# EAGLE design electronics 2 2023 (EAGLE 9.6.2)

## Sheet 1 of 2
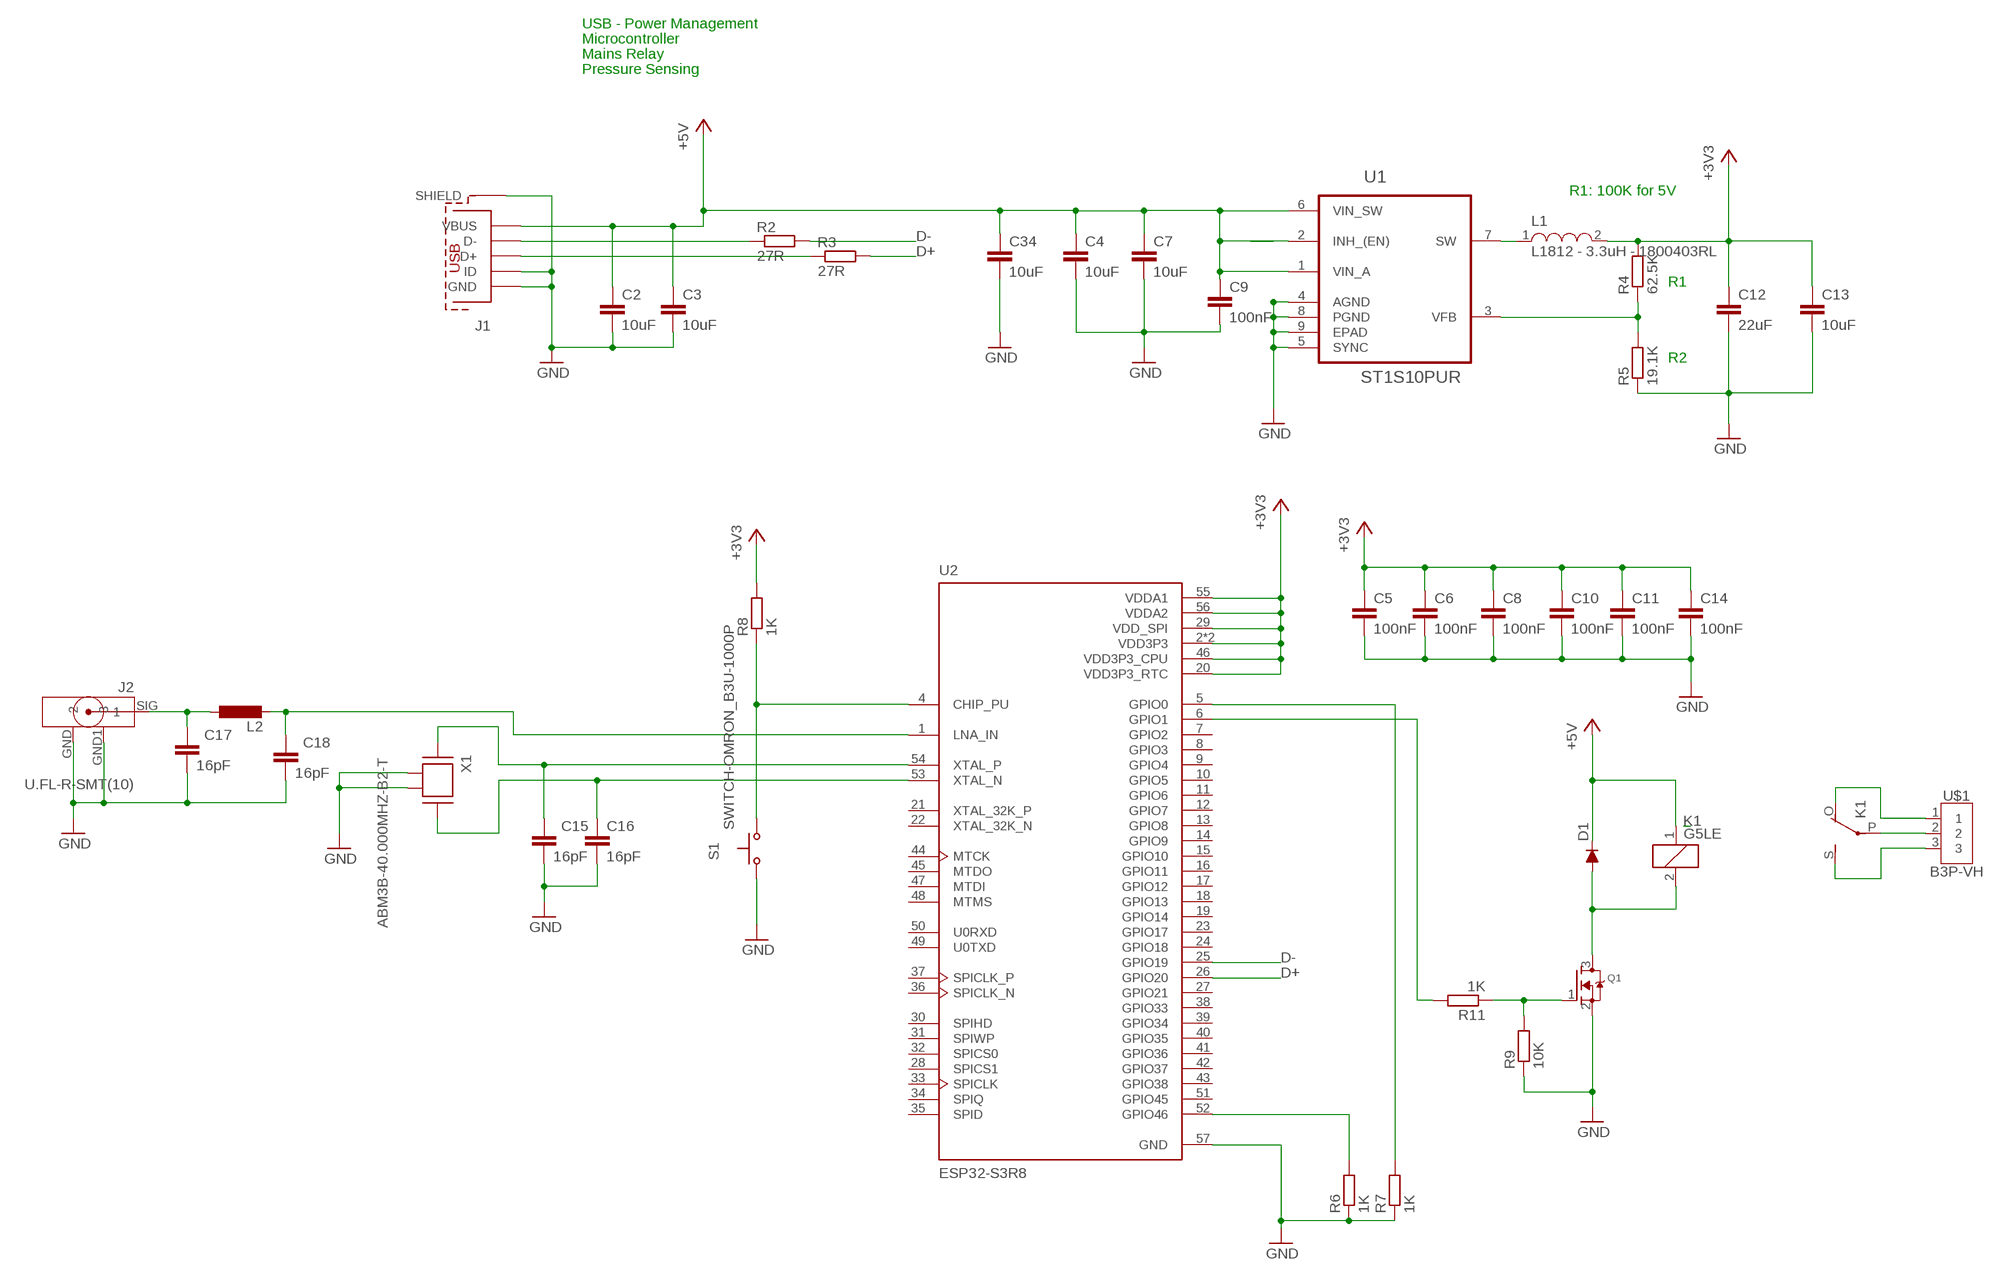
[diagram p0: schematic, sheet 1]

### Parts
C2  10uF  C-EUC0603  [C0603]
C3  10uF  C-EUC0603  [C0603]
C4  10uF  C-EUC0603  [C0603]
C5  100nF  C-EUC0402  [C0402]
C6  100nF  C-EUC0402  [C0402]
C7  10uF  C-EUC0603  [C0603]
C8  100nF  C-EUC0402  [C0402]
C9  100nF  C-EUC0402  [C0402]
C10  100nF  C-EUC0402  [C0402]
C11  100nF  C-EUC0402  [C0402]
C12  22uF  C-EUC0603  [C0603]
C13  10uF  C-EUC0603  [C0603]
C14  100nF  C-EUC0402  [C0402]
C15  16pF  C-EUC0402  [C0402]
C16  16pF  C-EUC0402  [C0402]
C17  16pF  C-EUC0402  [C0402]
C18  16pF  C-EUC0402  [C0402]
C34  10uF  C-EUC0603  [C0603]
D1  DIODE_DIODE-SOD123  [DIODE_SOD123]
J1  MICRO-USB-SOCKET  [629105136821]
J2  U.FL-R-SMT(10)  [U.FL-R-SMT(10)]
K1  G5LE  [G5LE]
L1  L1812 - 3.3uH - 1800403RL  INDUCTOR-L1812  [L1812]
L2  L-EUL2012C  [L2012C]
Q1  MOSFET-NREFLOW  [SOT23]
R2  27R  R-EU_R0402  [R0402]
R3  27R  R-EU_R0402  [R0402]
R4  62.5K  R-EU_R0402  [R0402]
R5  19.1K  R-EU_R0402  [R0402]
R6  1K  R-EU_R0402  [R0402]
R7  1K  R-EU_R0402  [R0402]
R8  1K  R-EU_R0402  [R0402]
R9  10K  R-EU_R0402  [R0402]
R11  1K  R-EU_R0402  [R0402]
S1  SWITCH-OMRON_B3U-1000P  [SWITCH-OMRON_B3U-1000P]
U1  ST1S10PUR  [DFN400X400X100-9N]
U2  ESP32-S3R8  [QFN40P700X700X90-57N]
U$1  B3P-VH  [B3P-VH_396_3N]
X1  ABM3B-40.000MHZ-B2-T  [ABM3B-40.000MHZ-B2-T]

### Nets
+3V3: C5.1 C6.1 C8.1 C10.1 C11.1 C12.1 C13.1 C14.1 L1.2 R4.2 R8.2 U2.2(VDD3P3) U2.3(VDD3P3) U2.20(VDD3P3_RTC) U2.29(VDD_SPI) U2.46(VDD3P3_CPU) U2.55(VDDA1) U2.56(VDDA2) ; also sheet 2
+5V: C2.1 C3.1 C4.1 C7.1 C9.1 C34.1 D1.C J1.1(VBUS) K1.1 U1.1(VIN_A) U1.2(INH_(EN)) U1.6(VIN_SW)
D+: R3.2 U2.26(GPIO20)
D-: R2.2 U2.25(GPIO19)
GND: C2.2 C3.2 C4.2 C5.2 C6.2 C7.2 C8.2 C9.2 C10.2 C11.2 C12.2 C13.2 C14.2 C15.2 C16.2 C17.2 C18.2 C34.2 J1.4(ID) J1.5(GND) J1.SHELL1(SHIELD) J1.SHELL2(SHIELD) J1.SHELL3(SHIELD) J1.SHELL(SHIELD) J2.GND J2.GND1 Q1.2(S) R5.1 R6.1 R7.1 R9.1 S1.1(P) U1.4(AGND) U1.5(SYNC) U1.8(PGND) U1.9(EPAD) U2.57(GND) X1.2 X1.4 ; also sheet 2
N$1: J1.2(D-) R2.1
N$2: J1.3(D+) R3.1
N$3: R4.1 R5.2 U1.3(VFB)
N$4: L1.1 U1.7(SW)
N$7: C15.1 U2.54(XTAL_P) X1.1
N$8: C16.1 U2.53(XTAL_N) X1.3
N$9: R6.2 U2.52(GPIO46)
N$10: R7.2 U2.5(GPIO0)
N$11: C18.1 L2.2 U2.1(LNA_IN)
N$12: C17.1 J2.SIG L2.1
N$13: R8.1 S1.2(S) U2.4(CHIP_PU)
N$14: D1.A K1.2 Q1.3(D)
N$16: K1.P(2:P) U$1.2
N$17: Q1.1(G) R9.2 R11.1
N$18: K1.O(2:O) U$1.1
N$19: R11.2 U2.6(GPIO1)
N$20: K1.S(2:S) U$1.3
Unconnected: U2.7(GPIO2) U2.8(GPIO3) U2.9(GPIO4) U2.10(GPIO5) U2.11(GPIO6) U2.12(GPIO7) U2.13(GPIO8) U2.14(GPIO9) U2.15(GPIO10) U2.16(GPIO11) U2.17(GPIO12) U2.18(GPIO13) U2.19(GPIO14) U2.21(XTAL_32K_P) U2.22(XTAL_32K_N) U2.23(GPIO17) U2.24(GPIO18) U2.27(GPIO21) U2.28(SPICS1) U2.30(SPIHD) U2.31(SPIWP) U2.32(SPICS0) U2.33(SPICLK) U2.34(SPIQ) U2.35(SPID) U2.36(SPICLK_N) U2.37(SPICLK_P) U2.38(GPIO33) U2.39(GPIO34) U2.40(GPIO35) U2.41(GPIO36) U2.42(GPIO37) U2.43(GPIO38) U2.44(MTCK) U2.45(MTDO) U2.47(MTDI) U2.48(MTMS) U2.49(U0TXD) U2.50(U0RXD) U2.51(GPIO45)

### Notes on the sheet
- USB - Power Management
- Microcontroller
- Mains Relay
- Pressure Sensing
- R1: 100K for 5V
- R1
- R2

## Sheet 2 of 2
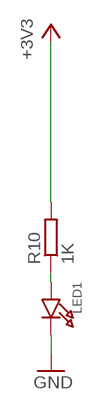
[diagram p1: schematic, sheet 2]

### Parts
LED1  LED0603  [CHIPLED_0603]
R10  1K  R-EU_R0402  [R0402]

### Nets
+3V3: R10.2 ; also sheet 1
GND: LED1.C ; also sheet 1
N$5: LED1.A R10.1

## Library data of the parts
C2 C3 C5 C6 C8 C10 C11 C14-C18 = rcl:C-EU: CAPACITOR, European symbol; SPICEPREFIX: C
C4 C7 C9 C12 C13 C34 = resistor:C-EU: CAPACITOR, European symbol
D1 = 52101-101-REV-A_v16:DIODE_DIODE-: DIODE
J1 = J-Wurth-629105136821-Micro-USB-A:MICRO-USB-SOCKET: WR-COM SMT Horizontal 5 Contacts Micro USB Type B,5 pins=>Code : Con_I-O_COM_MicroUSB_629105136821 <http://katalog.we-online.de/media/images/eican/Con_I-O_COM_MicroUSB_629105136821_pf2.jpg> Details see: http://katalog.we-online.de/en/em/COM_MICRO_SMT_TYPE_B_HORIZONTAL/629105136821?m Created 2014-07-09, Karrer Zheng 2014 (C) Würth Elektronik
J2 = Connectors:U.FL-R-SMT(10): CONN U.FL RCPT STR 50 OHM SMD Manufacturer's datasheet <https://media.digikey.com/pdf/Data%20Sheets/Hirose%20PDFs/UFL%20Series.pdf>; CREATED_BY: PCBLayout.com; DIGIKEY_PART_NUMBER: H9161CT-ND; MANUFACTURER: Hirose Electric Co Ltd; MPN: U.FL-R-SMT(10); PACKAGE: SMD
K1 = Bench Machine Front:G5LE: RELAY 1 x switch, 10 A/120 V AC, 8 A/30 V DC, Omron; OC_FARNELL: unknown; OC_NEWARK: unknown
L1 = dp_devices:INDUCTOR: Inductor
L2 = Main PCB 2v0 RDA8810PL:L-EU: INDUCTOR, European symbol
LED1 = 2mm connector:LED: LED 0603 - 0603 Surface Mount Package 2mA: Green LED - Low Power (3.9mcd, 2ma, 1.7Vf) - Digikey: 475-2709-2-ND Orange LED - Low Power (9.8mcd, 2ma, 1.8Vf) - Digikey: 475-1194-2-ND Red LED - Low Power (5mcd, 2ma, 1.8Vf) - Digikey: 475-1195-2-ND Yellow LED - Low Power (7mcd, 2ma, 1.8Vf) - Digikey: 475-1196-2-ND 5mA: Blue LED - Low Power (17mcd, 5ma, 2.9Vf) - Digikey: LNJ937W8CRACT-ND 0805 - 0805 Surface Mount Package 2mA: Red LED (8.8mcd, 2mA, 1.8Vf, Clear) - Low Power [Digikey: 475-2510-1-ND] Green LED (5mcd, 2mA, 1.8Vf, Clear) - Low Power [Digikey: 475-2730-1-ND] Yellow LED (11.3mcd, 2mA, 1.8Vf, Clear) - Low Power [Digikey: 475-2555-1-ND] 20mA: Red LED (104mcd, 20mA, Diffused) - LS R976 [Digikey: 475-1278-6-ND] Red LED (12mcd, 20mA, 2.0Vf, Clear) - APT2012EC [Digikey: 754-1128-1-ND] Green LED (15mcd, 20mA, 2.2Vf, Clear) - APT2012GC [Digikey: 754-1131-1-ND] Orange LED (160mcd, 20mA, 2.1Vf, Clear) - APT2012SECK [Digikey: 754-1130-1-ND] 1206 - 1206 Surface Mount Package Green LED (26mcd, 20mA, Diffused) - LG N971 [Digikey: 475-1407-6-ND] Red LED (15mcd, 20mA, Diffused) - LH N974 [Digikey: 475-1416-6-ND]
Q1 = Bench Machine Power Management:MOSFET-N: N-Channel Mosfet 2N7002E - 60V 260mA SOT23 [Digikey: 2N7002ET1GOSTR-ND] - REEL BSH103 - 30V 850mA SOT23 [Digikey: 568-5013-1-ND]
R2-R11 = resistor:R-EU_: RESISTOR, European symbol
S1 = 52101-101-REV-A_v16:SWITCH-OMRON_B3U-1000P: SMD Tactile Switch - Ultra Small
U1 = ST1S10 8DFN:ST1S10PUR: BUCK, 2.5-18V, 900KHZ, 3A, 0.8V, 8DFN; MPN: ST1S10PUR; OC_FARNELL: 2253494; OC_NEWARK: 94W9598; PACKAGE: DFN8 (4 x 4 mm); SUPPLIER: STMicroelectronics
U2 = ESP32-S3R8:ESP32-S3R8: Check availability <https://pricing.snapeda.com/parts/ESP32-S3R8/Espressif%20Systems/view-part?ref=eda> Check availability <https://pricing.snapeda.com/parts/ESP32-S3R8/Espressif%20Systems/view-part?ref=eda> Check availability <https://pricing.snapeda.com/parts/ESP32-S3R8/Espressif%20Systems/view-part?ref=eda>; AVAILABILITY: In Stock; DESCRIPTION: IC RF TxRx + MCU Bluetooth, WiFi 802.11b/g/n, Bluetooth v5.0 2.412GHz ~ 2.484GHz 56-VFQFN Exposed Pad; MF: Espressif Systems; MP: ESP32-S3R8; PACKAGE: None; PRICE: None; PURCHASE-URL: https://pricing.snapeda.com/search/part/ESP32-S3R8/?ref=eda
U$1 = Connector:B3P-VH: VH Connector Top Entry - POS, 3POS 7.92MM Details see: Datasheet <http://www.jst-mfg.com/product/pdf/eng/eVH.pdf>; CATEGORY: Connector; DESCRIPTION: CONN HEADER VERT 3POS 3.96MM; MANUFACTURER: JST Sales America Inc.; MPN: B3P-VH; OPERATING_TEMPERATURE: -25°C ~ 85°C; PART_STATUS: Active; ROHS_COMPLIANCE: RoHS2 Compliant; SERIES: VH; TYPE: Top Entry
X1 = Crystals_Oscillators:ABM3B-40.000MHZ-B2-T: CRYSTAL 40.0000MHZ 18PF SMD Manufacturer's datasheet <https://abracon.com/Resonators/abm3b.pdf>; CREATED_BY: PCBLayout.com; DIGIKEY_PART_NUMBER: 535-9132-2-ND; MANUFACTURER: Abracon LLC; MPN: ABM3B-40.000MHZ-B2-T; PACKAGE: SMD 4

## Board
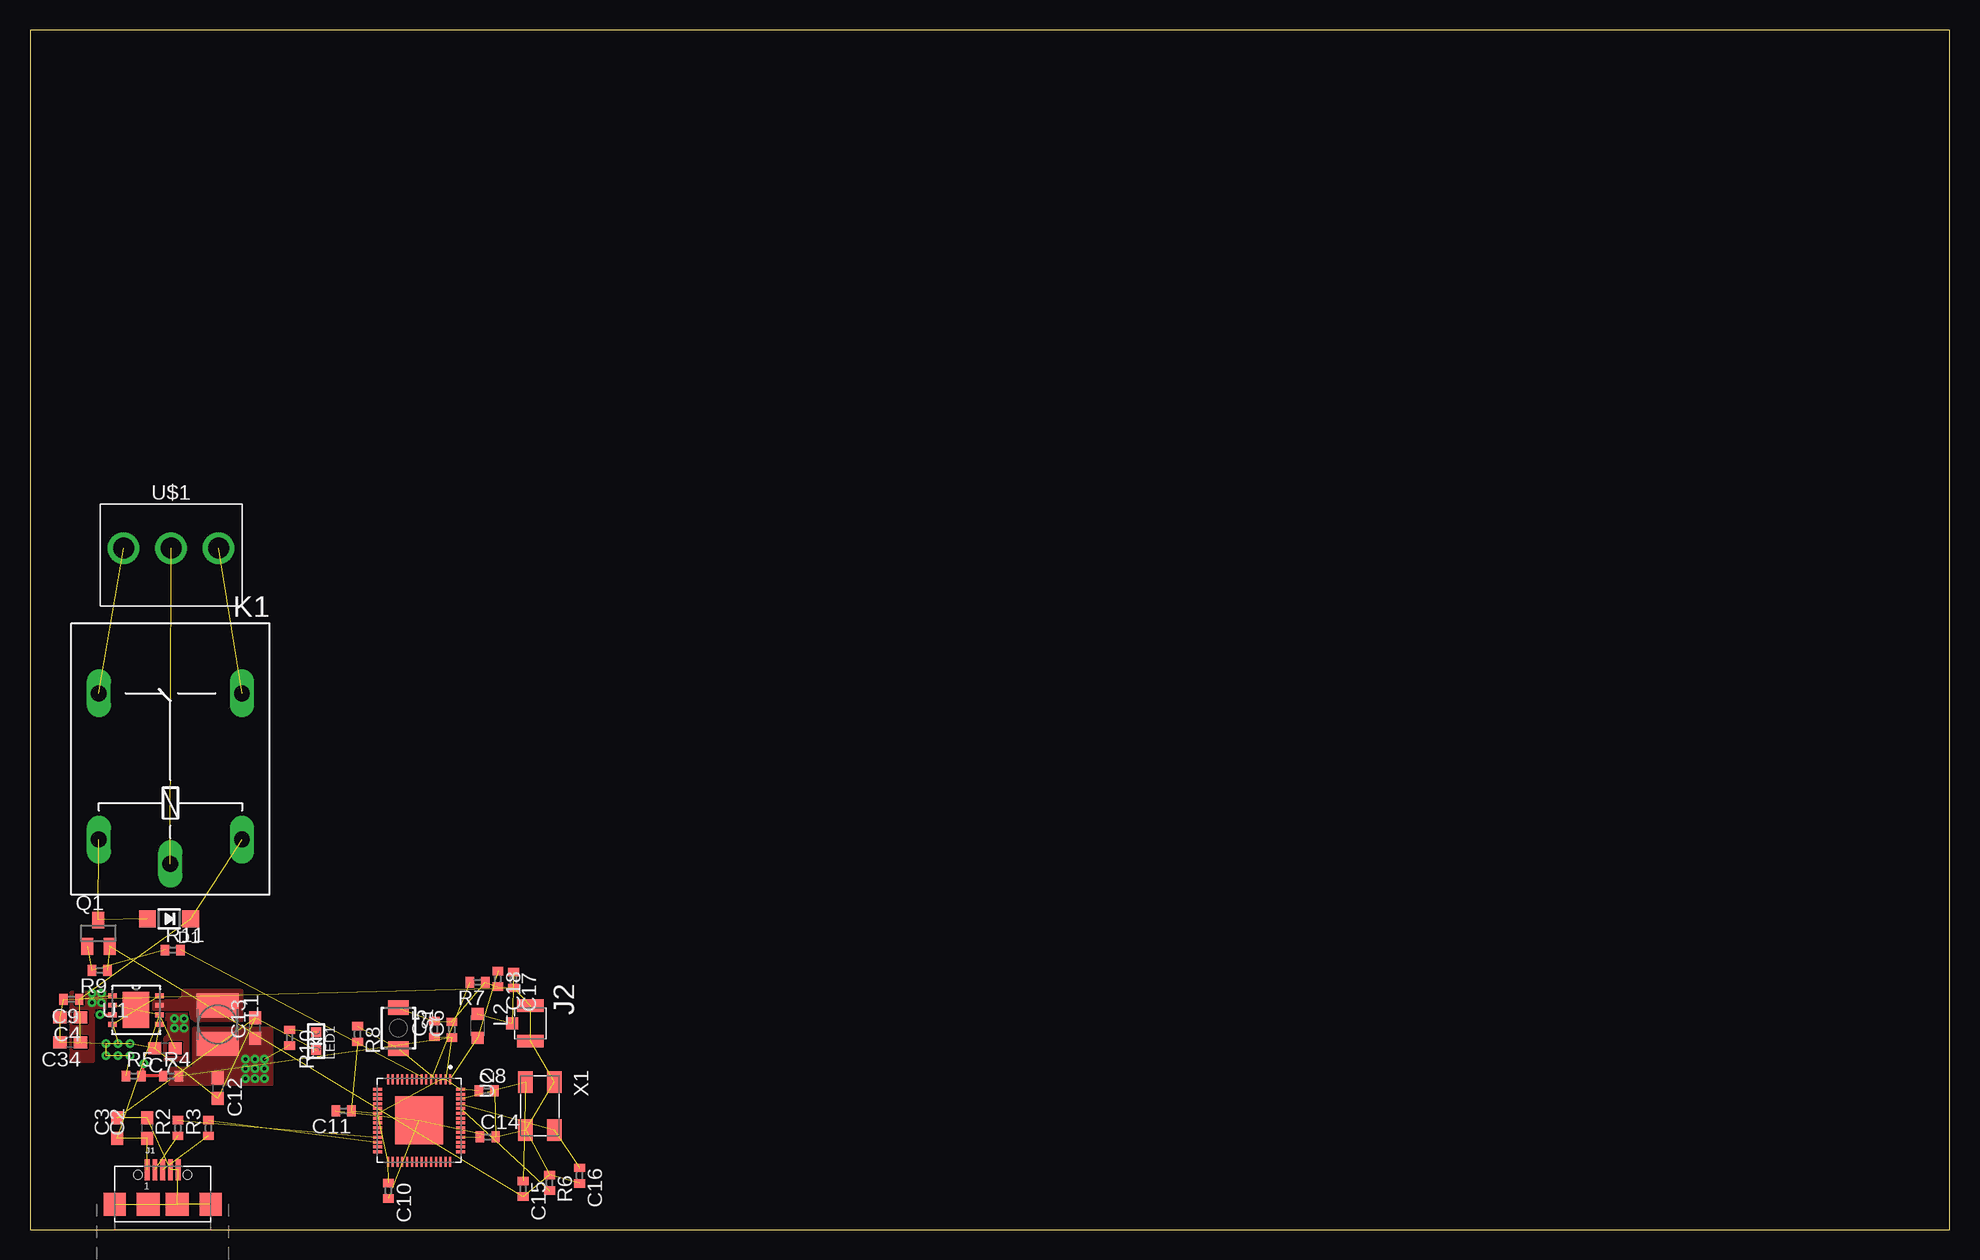
[diagram p2: board, top side]
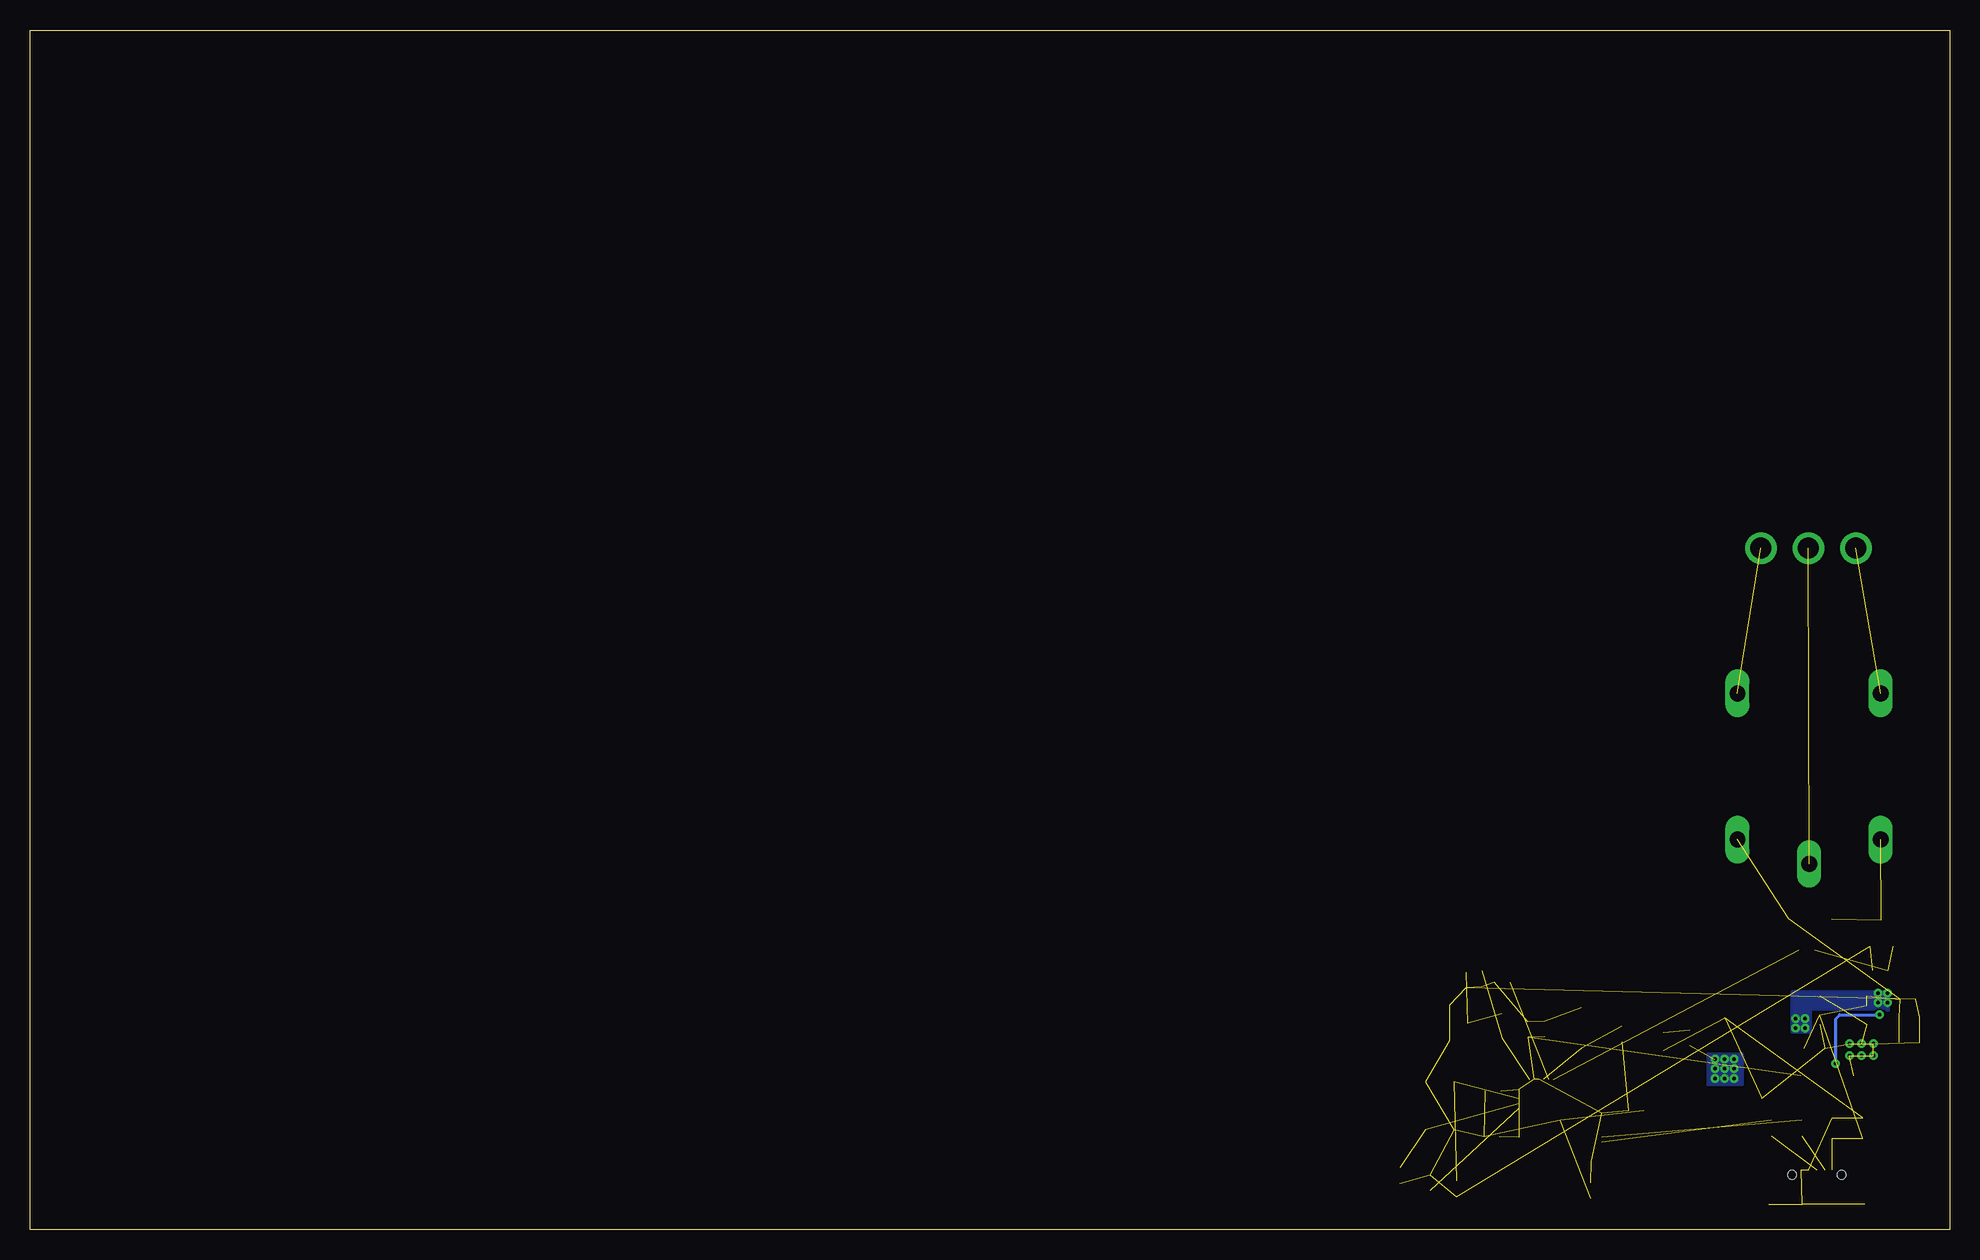
[diagram p3: board, bottom side, seen from below]

Size 160 x 100 mm. Coordinates in mm from the lower left corner, seen from the top.
Outline: 0,0 160,0 160,100 0,100 0,0
Copper layers (1*16): Top 0.035mm / dielectric 1.5mm / Bottom 0.035mm
Design rules "default": minimum track width 6mil, minimum drill 0.35mm, track to track 6mil, track to pad 6mil, pad to pad 6mil, via to via 6mil, smd to smd 6mil, copper to edge 40mil, drill to drill 6mil, minimum pad ring 10mil, minimum via ring 8mil, stop-mask expansion 4mil, vias tented up to drill 0mil, thermal gap 10mil

### Footprints (pad centres in the part's own frame; a part is rotated, then mirrored left to right if it is on the bottom)
C0603 = smd 1.1 x 1: 1 -0.85,0; 2 0.85,0
C0402 = smd 0.7 x 0.9: 1 -0.65,0; 2 0.65,0
DIODE_SOD123 = smd 1.4 x 1.4: A 1.805,0; C -1.805,0
629105136821 = smd 0.4 x 1.731: 1 -1.3,2.865; 2 -0.65,2.865; 3 0,2.865; 4 0.65,2.865; 5 1.3,2.865 | smd 1.8 x 1.9: SHELL -4,0; SHELL3 4,0 | smd 1.9 x 1.9: SHELL1 -1.2,0; SHELL2 1.2,0 | hole 0.7: -2.075,2.45; 2.075,2.45
U.FL-R-SMT(10) = smd 1.05 x 2.2: GND -1.475,0; GND1 1.475,0 | smd 1 x 1: SIG 0,-1.525
G5LE = drill 1.321 long: 1 -7.493,-5.969; 2 -7.493,5.969; O 4.699,5.969; P -9.525,0; S 4.699,-5.969
L1812 = smd 2 x 3.5: 1 -1.6,0; 2 1.6,0
L2012C = smd 1 x 1: 1 -1,0; 2 1,0
CHIPLED_0603 = smd 0.8 x 0.8: A 0,-0.75; C 0,0.75
SOT23 = smd 1 x 1.4: 1 -0.95,-1.1; 2 0.95,-1.1; 3 0,1.1
R0402 = smd 0.7 x 0.9: 1 -0.65,0; 2 0.65,0
SWITCH-OMRON_B3U-1000P = smd 1.2 x 1.7: 1 -1.7,0; 2 1.7,0
DFN400X400X100-9N = smd 0.711 x 0.406: 1 -1.956,1.194; 2 -1.956,0.406; 3 -1.956,-0.406; 4 -1.956,-1.194; 5 1.956,-1.194; 6 1.956,-0.406; 7 1.956,0.406; 8 1.956,1.194 | smd 2.21 x 2.997: 9 0,0
QFN40P700X700X90-57N = smd 0.81 x 0.22: 1 -3.445,2.6; 2 -3.445,2.2; 3 -3.445,1.8; 4 -3.445,1.4; 5 -3.445,1; 6 -3.445,0.6; 7 -3.445,0.2; 8 -3.445,-0.2; 9 -3.445,-0.6; 10 -3.445,-1; 11 -3.445,-1.4; 12 -3.445,-1.8; 13 -3.445,-2.2; 14 -3.445,-2.6; 29 3.445,-2.6; 30 3.445,-2.2; 31 3.445,-1.8; 32 3.445,-1.4; 33 3.445,-1; 34 3.445,-0.6; 35 3.445,-0.2; 36 3.445,0.2; 37 3.445,0.6; 38 3.445,1; 39 3.445,1.4; 40 3.445,1.8; 41 3.445,2.2; 42 3.445,2.6 | smd 0.22 x 0.81: 15 -2.6,-3.445; 16 -2.2,-3.445; 17 -1.8,-3.445; 18 -1.4,-3.445; 19 -1,-3.445; 20 -0.6,-3.445; 21 -0.2,-3.445; 22 0.2,-3.445; 23 0.6,-3.445; 24 1,-3.445; 25 1.4,-3.445; 26 1.8,-3.445; 27 2.2,-3.445; 28 2.6,-3.445; 43 2.6,3.445; 44 2.2,3.445; 45 1.8,3.445; 46 1.4,3.445; 47 1,3.445; 48 0.6,3.445; 49 0.2,3.445; 50 -0.2,3.445; 51 -0.6,3.445; 52 -1,3.445; 53 -1.4,3.445; 54 -1.8,3.445; 55 -2.2,3.445; 56 -2.6,3.445 | smd 4 x 4: 57 0,0
B3P-VH_396_3N = drill 1.75: 1 0,0; 2 3.96,0; 3 7.92,0
ABM3B-40.000MHZ-B2-T = smd 1.8 x 1.2: 1 -2,-1.2; 2 2,-1.2; 3 2,1.2; 4 -2,1.2

### Placement (x,y rotation side)
C2  9.79,8.46 90 top
C3  7.25,8.46 90 top
C4  3.35,17.7 180 top
C5  33.71,16.71 90 top
C6  35.16,16.66 90 top
C7  11.25,15.1 180 top
C8  38.06,11.56 0 top
C9  3.45,19.2 180 top
C10  29.88,3.24 270 top
C11  26.14,9.9 180 top
C12  15.65,11.8 270 top
C13  18.75,16.8 90 top
C14  38.16,7.72 0 top
C15  41.1,3.4 270 top
C16  45.8,4.5 270 top
C17  40.3,20.8 270 top
C18  39,20.9 270 top
C34  3.35,15.6 180 top
D1  11.6,25.9 180 top
J1  11.06,2.11 0 top
J2  41.7,17.2 270 top
K1  11.7,40 90 top
L1  15.65,17.1 270 top
L2  37.3,17 270 top
LED1  23.85,15.7 180 top
Q1  5.7,24.7 0 top
R2  12.33,8.46 90 top
R3  14.87,8.46 90 top
R4  11.75,12.8 0 top
R5  8.65,12.8 0 top
R6  43.3,3.9 270 top
R7  37.3,20.6 180 top
R8  27.3,16.3 270 top
R9  5.8,21.6 180 top
R10  21.65,16 270 top
R11  11.9,23.3 0 top
S1  30.7,16.8 270 top
U1  8.85,18.3 0 top
U2  32.44,9.09 270 top
U$1  7.8,56.8 0 top
X1  42.5,10.3 270 top

### Tracks (layer width: path | path; a pad name or v marks a point on that pad's centre or on a via)
+3V3  (via drill 0.3)  (15 unrouted)
  other vias: 19.55,12.6 19.55,13.4 19.55,14.2 18.75,12.6 18.75,13.4 18.75,14.2 17.95,14.2 17.95,13.4 17.95,12.6
  pour Top (no thermals): 13.65,16.8 20.15,16.8 20.15,12.1 11.65,12.1 11.65,13.5 13.65,13.5
  pour Bottom: 20.15,12.1 17.25,12.1 17.25,14.6 20.15,14.6
+5V  (11 unrouted)
+12V  (via drill 0.3)
  other vias: 12.85,16.8 12.05,16.8 12.05,17.6 12.85,17.6 5.95,18.9 5.95,19.7 5.15,19.7 5.15,18.9
  pour Top (no thermals): 5.25,14 3.45,14 3.45,19.8 7.45,19.8 7.45,18.4 6.15,18.4 6.05,18.5 5.45,18.5 5.25,18.3
  pour Bottom: 11.55,18.4 6.15,18.4 6.05,18.5 5.45,18.5 5.25,18.3 5.05,18.3 5.05,19.8 13.15,19.8 13.15,16.5 11.55,16.5
  pour Top (rank 4, no thermals): 11.55,17.5 10.35,17.5 10.35,18.2 12.95,18.2 13.15,18 13.15,14.1 11.25,14.1 11.25,16 11.55,16.3
D+  (1 unrouted)
D-  (1 unrouted)
GND  (via drill 0.3)  (45 unrouted)
  other vias: 8.35,14.5 7.35,14.5 6.35,14.5 6.35,15.5 7.35,15.5 8.35,15.5
N$1  (1 unrouted)
N$2  (1 unrouted)
N$3  (via drill 0.3)
  Top 0.254: R4.1 R5.2 9.45,12.9 9.45,13.85 v9.5,13.85 | v5.85,17.9 U1.3
  Bottom 0.254: v9.5,13.85 9.5,17.55 9.15,17.9 v5.85,17.9
N$4
  pour Top (no thermals): 10.35,19.1 12.35,19.1 12.75,19.5 12.75,19.9 12.85,20 17.55,20 17.65,19.9 17.65,17.4 13.75,17.4 13.45,17.7 13.45,18.2 13.35,18.3 10.35,18.3
N$5  (1 unrouted)
N$7  (2 unrouted)
N$8  (2 unrouted)
N$9  (1 unrouted)
N$10  (1 unrouted)
N$11  (2 unrouted)
N$12  (2 unrouted)
N$13  (2 unrouted)
N$14  (2 unrouted)
N$16  (1 unrouted)
N$17  (2 unrouted)
N$18  (1 unrouted)
N$19  (1 unrouted)
N$20  (1 unrouted)